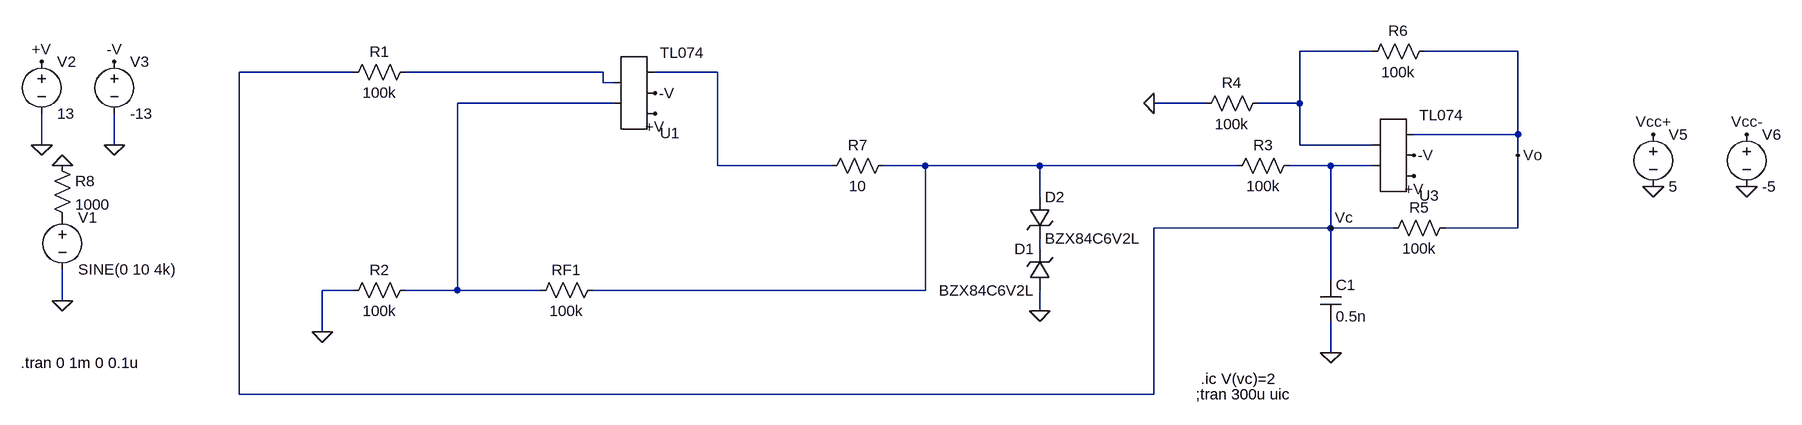
[diagram p0: schematic Ej3_Sedra7_4v_tl074.asc]
Ej3_Sedra7_4v_tl074.asc, the LTspice schematic file:
Version 4
SHEET 1 2184 704
WIRE 1552 160 1440 160
WIRE 1776 160 1632 160
WIRE -16 192 -192 192
WIRE 368 192 64 192
WIRE 544 192 448 192
WIRE 368 208 368 192
WIRE 384 208 368 208
WIRE 384 240 144 240
WIRE 1296 240 1216 240
WIRE 1440 240 1440 160
WIRE 1440 240 1376 240
WIRE 1776 288 1776 160
WIRE 1776 288 1616 288
WIRE -496 304 -496 256
WIRE -384 304 -384 256
WIRE 1440 304 1440 240
WIRE 1552 304 1440 304
WIRE 1776 320 1776 288
WIRE 544 336 544 192
WIRE 720 336 544 336
WIRE 864 336 800 336
WIRE 1040 336 864 336
WIRE 1344 336 1040 336
WIRE 1488 336 1424 336
WIRE 1552 336 1488 336
WIRE 1040 384 1040 336
WIRE 1488 432 1488 336
WIRE 1488 432 1216 432
WIRE 1584 432 1488 432
WIRE 1776 432 1776 320
WIRE 1776 432 1664 432
WIRE 1040 464 1040 448
WIRE 1488 512 1488 432
WIRE -16 528 -64 528
WIRE 144 528 144 240
WIRE 144 528 64 528
WIRE 272 528 144 528
WIRE 864 528 864 336
WIRE 864 528 352 528
WIRE -464 544 -464 496
WIRE 1040 560 1040 528
WIRE -64 592 -64 528
WIRE 1488 624 1488 576
WIRE -192 688 -192 192
WIRE 1216 688 1216 432
WIRE 1216 688 -192 688
FLAG -464 544 0
FLAG -64 592 0
FLAG 448 256 +V
FLAG 448 224 -V
FLAG -496 304 0
FLAG -384 304 0
FLAG -496 176 +V
FLAG -384 176 -V
FLAG 1984 368 0
FLAG 2128 368 0
FLAG 1984 288 Vcc+
FLAG 2128 288 Vcc-
FLAG 1216 240 0
FLAG 1488 624 0
FLAG 1776 320 Vo
FLAG 1488 432 Vc
FLAG 1040 560 0
FLAG -464 336 0
FLAG 1616 352 +V
FLAG 1616 320 -V
SYMBOL res 80 176 R90
WINDOW 0 0 56 VBottom 2
WINDOW 3 32 56 VTop 2
SYMATTR InstName R1
SYMATTR Value 100k
SYMBOL res 80 512 R90
WINDOW 0 0 56 VBottom 2
WINDOW 3 32 56 VTop 2
SYMATTR InstName R2
SYMATTR Value 100k
SYMBOL res 368 512 R90
WINDOW 0 0 56 VBottom 2
WINDOW 3 32 56 VTop 2
SYMATTR InstName RF1
SYMATTR Value 100k
SYMBOL voltage -464 400 R0
WINDOW 123 0 0 Left 2
WINDOW 39 0 0 Left 2
SYMATTR InstName V1
SYMATTR Value SINE(0 10 4k)
SYMBOL voltage -496 160 R0
WINDOW 123 0 0 Left 2
WINDOW 39 0 0 Left 2
SYMATTR InstName V2
SYMATTR Value 13
SYMBOL voltage -384 160 R0
WINDOW 123 0 0 Left 2
WINDOW 39 0 0 Left 2
SYMATTR InstName V3
SYMATTR Value -13
SYMBOL res 1440 320 R90
WINDOW 0 0 56 VBottom 2
WINDOW 3 32 56 VTop 2
SYMATTR InstName R3
SYMATTR Value 100k
SYMBOL voltage 1984 272 R0
SYMATTR InstName V5
SYMATTR Value 5
SYMBOL voltage 2128 272 R0
SYMATTR InstName V6
SYMATTR Value -5
SYMBOL res 1392 224 R90
WINDOW 0 0 56 VBottom 2
WINDOW 3 32 56 VTop 2
SYMATTR InstName R4
SYMATTR Value 100k
SYMBOL res 1680 416 R90
WINDOW 0 0 56 VBottom 2
WINDOW 3 32 56 VTop 2
SYMATTR InstName R5
SYMATTR Value 100k
SYMBOL cap 1472 512 R0
SYMATTR InstName C1
SYMATTR Value 0.5n
SYMBOL res 1648 144 R90
WINDOW 0 0 56 VBottom 2
WINDOW 3 32 56 VTop 2
SYMATTR InstName R6
SYMATTR Value 100k
SYMBOL res 816 320 R90
WINDOW 0 0 56 VBottom 2
WINDOW 3 32 56 VTop 2
SYMATTR InstName R7
SYMATTR Value 10
SYMBOL res -480 320 R0
SYMATTR InstName R8
SYMATTR Value 1000
SYMBOL zener 1024 384 R0
SYMATTR InstName D2
SYMATTR Value BZX84C6V2L
SYMBOL zener 1056 528 R180
WINDOW 0 24 64 Left 2
WINDOW 3 24 0 Left 2
SYMATTR InstName D1
SYMATTR Value BZX84C6V2L
SYMBOL AutoGenerated/TL074 416 224 M180
SYMATTR InstName U1
SYMBOL AutoGenerated/TL074 1584 320 M180
SYMATTR InstName U3
TEXT -528 640 Left 2 !.tran 0 1m 0 0.1u
TEXT 1280 688 Left 2 !;tran 300u uic
TEXT 1288 664 Left 2 !.ic V(vc)=2

The netlist it stands for:
* Ej3_Sedra7_4v_tl074.asc
R1 N002 Vc 100k
R2 N004 0 100k
RF1 N005 N004 100k
V1 P001 0 SINE(0 10 4k)
V2 +V 0 13
V3 -V 0 -13
R3 Vc N005 100k
V5 Vcc+ 0 5
V6 Vcc- 0 -5
R4 N001 0 100k
R5 Vo Vc 100k
C1 Vc 0 0.5n
R6 Vo N001 100k
R7 N005 N003 10
R8 0 P001 1000
D2 N005 N006 BZX84C6V2L
D1 0 N006 BZX84C6V2L
* U1: TL074 (symbol AutoGenerated/TL074 not available, pins judged from their places): pin1=N004 pin2=N002 pin3=+V pin4=-V pin5=N003
* U3: TL074 (symbol AutoGenerated/TL074 not available, pins judged from their places): pin1=Vc pin2=N001 pin3=+V pin4=-V pin5=Vo
.model D D
.lib standard.dio
.tran 0 1m 0 0.1u
;tran 300u uic
.ic V(vc)=2
.backanno
.end